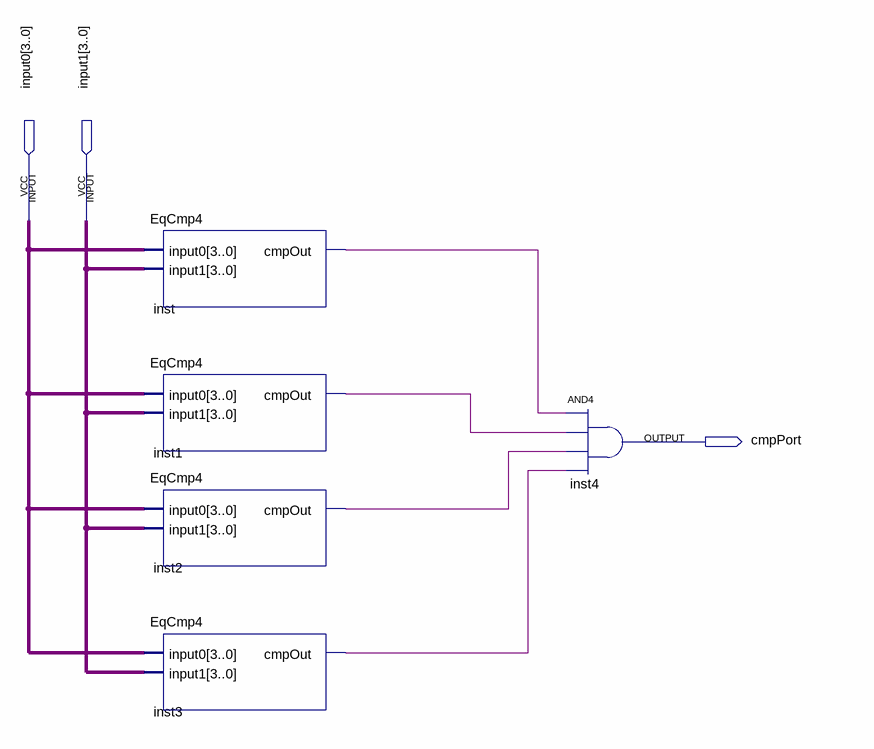
[diagram p0: schematic sheet]
// Quartus schematic 16bitcomparator.bdf as structural Verilog: 5 symbols, 3 pins
module \16bitcomparator  (
  input  [3:0] input0,
  input  [3:0] input1,
  output cmpPort
);

  wire inst1_cmpout, inst2_cmpout, inst3_cmpout, inst_cmpout;

  EqCmp4 inst (.input0(input0), .input1(input1), .cmpOut(inst_cmpout));
  EqCmp4 inst1 (.input0(input0), .input1(input1), .cmpOut(inst1_cmpout));
  EqCmp4 inst2 (.input0(input0), .input1(input1), .cmpOut(inst2_cmpout));
  EqCmp4 inst3 (.input0(input0), .input1(input1), .cmpOut(inst3_cmpout));
  and inst4 (cmpPort, inst_cmpout, inst1_cmpout, inst2_cmpout, inst3_cmpout);
endmodule
